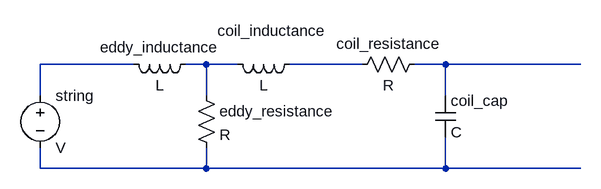
[diagram p0: schematic Draft1.asc]
Draft1.asc, the LTspice schematic file:
Version 4
SHEET 1 916 680
WIRE 224 80 80 80
WIRE 336 80 304 80
WIRE 384 80 336 80
WIRE 576 80 464 80
WIRE 704 80 656 80
WIRE 912 80 704 80
WIRE 80 128 80 80
WIRE 336 128 336 80
WIRE 704 128 704 80
WIRE 80 240 80 208
WIRE 336 240 336 208
WIRE 336 240 80 240
WIRE 704 240 704 192
WIRE 704 240 336 240
WIRE 912 240 704 240
SYMBOL voltage 80 112 R0
SYMATTR InstName string
SYMBOL ind 320 64 R90
WINDOW 0 5 56 VBottom 2
WINDOW 3 32 56 VTop 2
SYMATTR InstName eddy_inductance
SYMBOL ind 480 64 R90
WINDOW 0 -20 44 VBottom 2
WINDOW 3 32 56 VTop 2
SYMATTR InstName coil_inductance
SYMBOL res 672 64 R90
WINDOW 0 0 56 VBottom 2
WINDOW 3 32 56 VTop 2
SYMATTR InstName coil_resistance
SYMBOL res 320 112 R0
SYMATTR InstName eddy_resistance
SYMBOL cap 688 128 R0
SYMATTR InstName coil_cap

The netlist it stands for:
* Draft1.asc
V§string N001 N005 V
L§eddy_inductance N002 N001 L
L§coil_inductance N003 N002 L
R§coil_resistance N004 N003 R
R§eddy_resistance N002 N005 R
coil_cap N004 N005 C
.backanno
.end